# Altium schematic sheet USB_Board.SchDoc: USB_Stream_Board
size A; Revision: 0.0
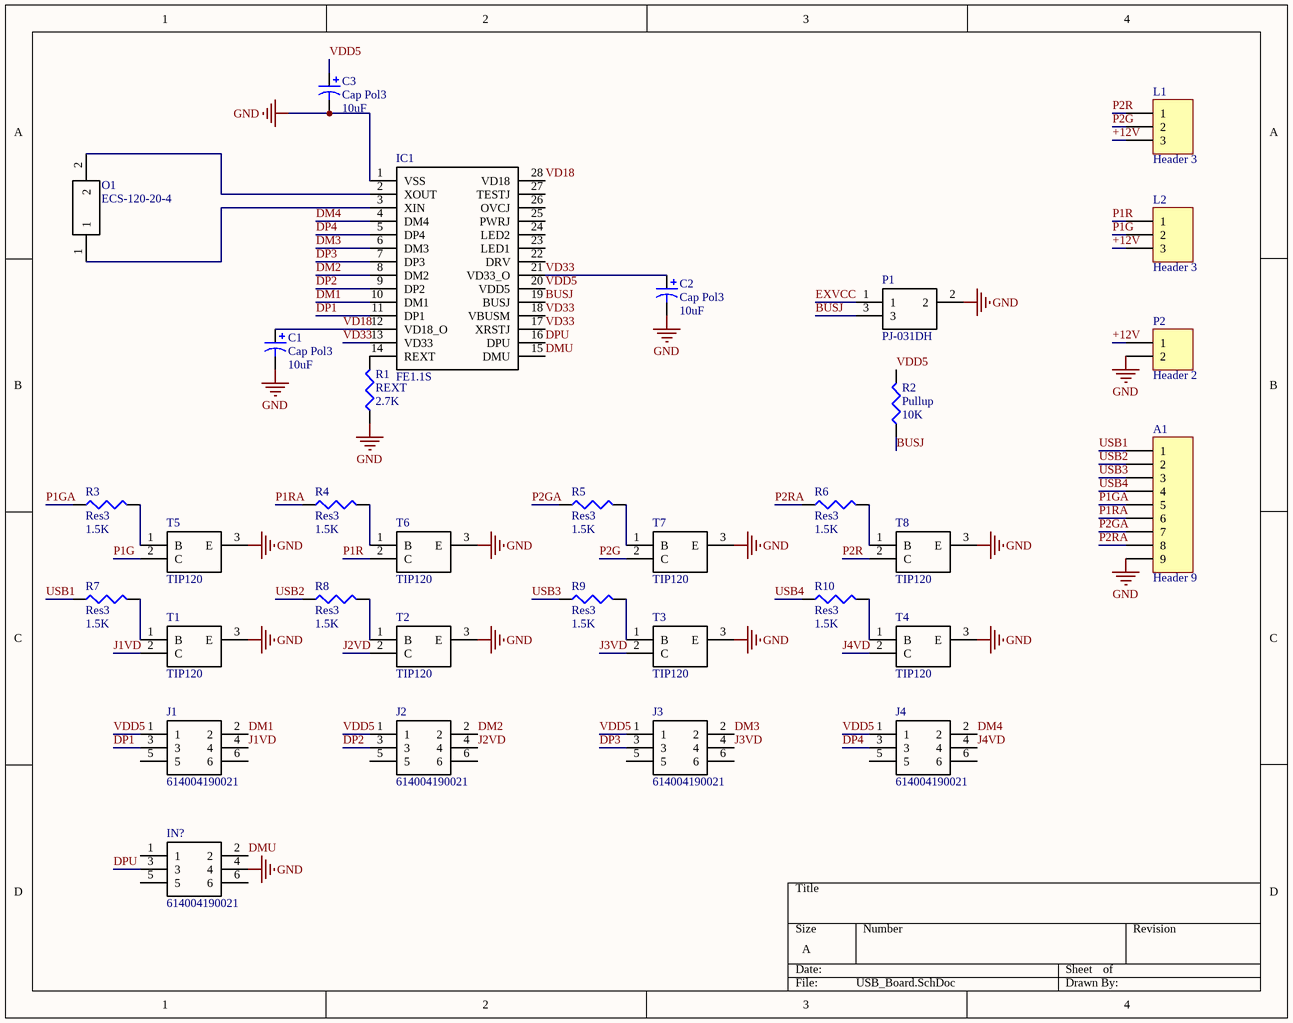
[diagram p0: USB_Board.SchDoc]

## Parts
A1  Header 9  [HDR1X9]
C1  Cap Pol3  value 10uF  [C0805]
C2  Cap Pol3  value 10uF  [C0805]
C3  Cap Pol3  value 10uF  [C0805]
IC1  FE1.1S  [SOP64P600X175-28N]
IN?  614004190021  [USB-2.0-TYPE-A]
J1  614004190021  [USB-2.0-TYPE-A]
J2  614004190021  [USB-2.0-TYPE-A]
J3  614004190021  [USB-2.0-TYPE-A]
J4  614004190021  [USB-2.0-TYPE-A]
L1  Header 3  [HDR1X3]
L2  Header 3  [HDR1X3]
O1  ECS-120-20-4  [HC-49USX]
P1  PJ-031DH  [PJ031DH]
P2  Header 2  [HDR1X2]
R1  REXT  value 2.7K  [J1-0603]
R2  Pullup  value 10K  [J1-0603]
R3  Res3  value 1.5K  [J1-0603]
R4  Res3  value 1.5K  [J1-0603]
R5  Res3  value 1.5K  [J1-0603]
R6  Res3  value 1.5K  [J1-0603]
R7  Res3  value 1.5K  [J1-0603]
R8  Res3  value 1.5K  [J1-0603]
R9  Res3  value 1.5K  [J1-0603]
R10  Res3  value 1.5K  [J1-0603]
T1  TIP120  [TO255P460X1020X2008-3P]
T2  TIP120  [TO255P460X1020X2008-3P]
T3  TIP120  [TO255P460X1020X2008-3P]
T4  TIP120  [TO255P460X1020X2008-3P]
T5  TIP120  [TO255P460X1020X2008-3P]
T6  TIP120  [TO255P460X1020X2008-3P]
T7  TIP120  [TO255P460X1020X2008-3P]
T8  TIP120  [TO255P460X1020X2008-3P]

## Nets
GND: A1.9 C1.2 C2.2 C3.2 IC1.1(VSS) IN?.4 P1.2 P2.2 R1.1 T1.3(E) T2.3(E) T3.3(E) T4.3(E) T5.3(E) T6.3(E) T7.3(E) T8.3(E)
+12V: L1.3 L2.3 P2.1
BUSJ: IC1.19(BUSJ) P1.3 R2.1
DM1: IC1.10(DM1) J1.2
DM2: IC1.8(DM2) J2.2
DM3: IC1.6(DM3) J3.2
DM4: IC1.4(DM4) J4.2
DMU: IC1.15(DMU) IN?.2
DP1: IC1.11(DP1) J1.3
DP2: IC1.9(DP2) J2.3
DP3: IC1.7(DP3) J3.3
DP4: IC1.5(DP4) J4.3
DPU: IC1.16(DPU) IN?.3
EXVCC: P1.1
J1VD: J1.4 T1.2(C)
J2VD: J2.4 T2.2(C)
J3VD: J3.4 T3.2(C)
J4VD: J4.4 T4.2(C)
P1G: L2.2 T5.2(C)
P1GA: A1.5 R3.1
P1R: L2.1 T6.2(C)
P1RA: A1.6 R4.1
P2G: L1.2 T7.2(C)
P2GA: A1.7 R5.1
P2R: L1.1 T8.2(C)
P2RA: A1.8 R6.1
USB1: A1.1 R7.1
USB2: A1.2 R8.1
USB3: A1.3 R9.1
USB4: A1.4 R10.1
VD18: C1.1 IC1.12(VD18_O) IC1.28(VD18)
VD33: C2.1 IC1.13(VD33) IC1.17(XRSTJ) IC1.18(VBUSM) IC1.21(VD33_O)
VDD5: C3.1 IC1.20(VDD5) J1.1 J2.1 J3.1 J4.1 R2.2
NetIC1_2: IC1.2(XOUT) O1.2
NetIC1_3: IC1.3(XIN) O1.1
NetIC1_14: IC1.14(REXT) R1.2
NetR3_2: R3.2 T5.1(B)
NetR4_2: R4.2 T6.1(B)
NetR5_2: R5.2 T7.1(B)
NetR6_2: R6.2 T8.1(B)
NetR7_2: R7.2 T1.1(B)
NetR8_2: R8.2 T2.1(B)
NetR9_2: R9.2 T3.1(B)
NetR10_2: R10.2 T4.1(B)

Not connected (* = marked no-connect by the designer): IC1 22(DRV) 23(LED1) 24(LED2) 25(PWRJ) 26(OVCJ) 27(TESTJ); IN? 1 5 6; J1 5 6; J2 5 6; J3 5 6; J4 5 6

## Library data of the parts
A1 = Header 9: Header, 9-Pin; LatestRevisionDate: 17-Jul-2002; LatestRevisionNote: Re-released for DXP Platform.; Publisher: Altium Limited
C1-C3 = Cap Pol3: Polarized Capacitor (Surface Mount); Published: 8-Jun-2000; LatestRevisionDate: 29-May-2009; LatestRevisionNote: IPC-7351 Footprint Added.; PackageReference: C0805; Publisher: Altium Limited; PackageDescription: Chip Capacitor
IC1 = FE1.1S: Integrated Circuit; Manufacturer_Name: JFD IC; Datasheet Link: https://cdn-shop.adafruit.com/product-files/2991/FE1.1s+Data+Sheet+(Rev.+1.0).pdf; Height: 1.75mm; Manufacturer_Part_Number: FE1.1S
IN? J1-J4 = 614004190021: Connector; Manufacturer_Name: Wurth Elektronik; Datasheet Link: http://katalog.we-online.de/em/datasheet/614004190021.pdf; Manufacturer_Part_Number: 614004190021; Mouser Part Number: 710-614004190021; Mouser Price/Stock: https://www.mouser.com/Search/Refine.aspx?Keyword=710-614004190021; RS Part Number: 1622149; RS Price/Stock: http://uk.rs-online.com/web/p/products/1622149
L1 L2 = Header 3: Header, 3-Pin; LatestRevisionDate: 17-Jul-2002; LatestRevisionNote: Re-released for DXP Platform.; Publisher: Altium Limited
O1 = ECS-120-20-4: Crystal or Oscillator; Manufacturer_Name: ECS; Datasheet Link: https://ecsxtal.com/store/pdf/hc_49us.pdf; Manufacturer_Part_Number: ECS-120-20-4; Mouser Part Number: 520-HCU1200-20; Mouser Price/Stock: https://www.mouser.com/Search/Refine.aspx?Keyword=520-HCU1200-20
P1 = PJ-031DH: Connector; Manufacturer_Name: CUI; Datasheet Link: https://www.cui.com/product/resource/pj-031dh.pdf; Height: 7mm; Manufacturer_Part_Number: PJ-031DH; Mouser Part Number: 490-PJ-031DH; Mouser Price/Stock: https://www.mouser.com/Search/Refine.aspx?Keyword=490-PJ-031DH
P2 = Header 2: Header, 2-Pin; LatestRevisionDate: 17-Jul-2002; LatestRevisionNote: Re-released for DXP Platform.; Publisher: Altium Limited
R1-R10 = Res3: Resistor; Published: 8-Jun-2000; LatestRevisionDate: 29-May-2009; LatestRevisionNote: IPC-7351 Footprint Added.; PackageReference: J1-0603; Publisher: Altium Limited; PackageDescription: Chip Resistor
T1-T8 = TIP120: Transistor Darlington Pair; Manufacturer_Name: STMicroelectronics; Datasheet Link: https://www.st.com/resource/en/datasheet/cd00000911.pdf; Height: 4.6mm; Manufacturer_Part_Number: TIP120; Mouser Part Number: 511-TIP120; Mouser Price/Stock: https://www.mouser.com/Search/Refine.aspx?Keyword=511-TIP120; RS Part Number: 3133175; RS Price/Stock: http://uk.rs-online.com/web/p/products/3133175